# EAGLE design receiver (EAGLE 7.4.0)
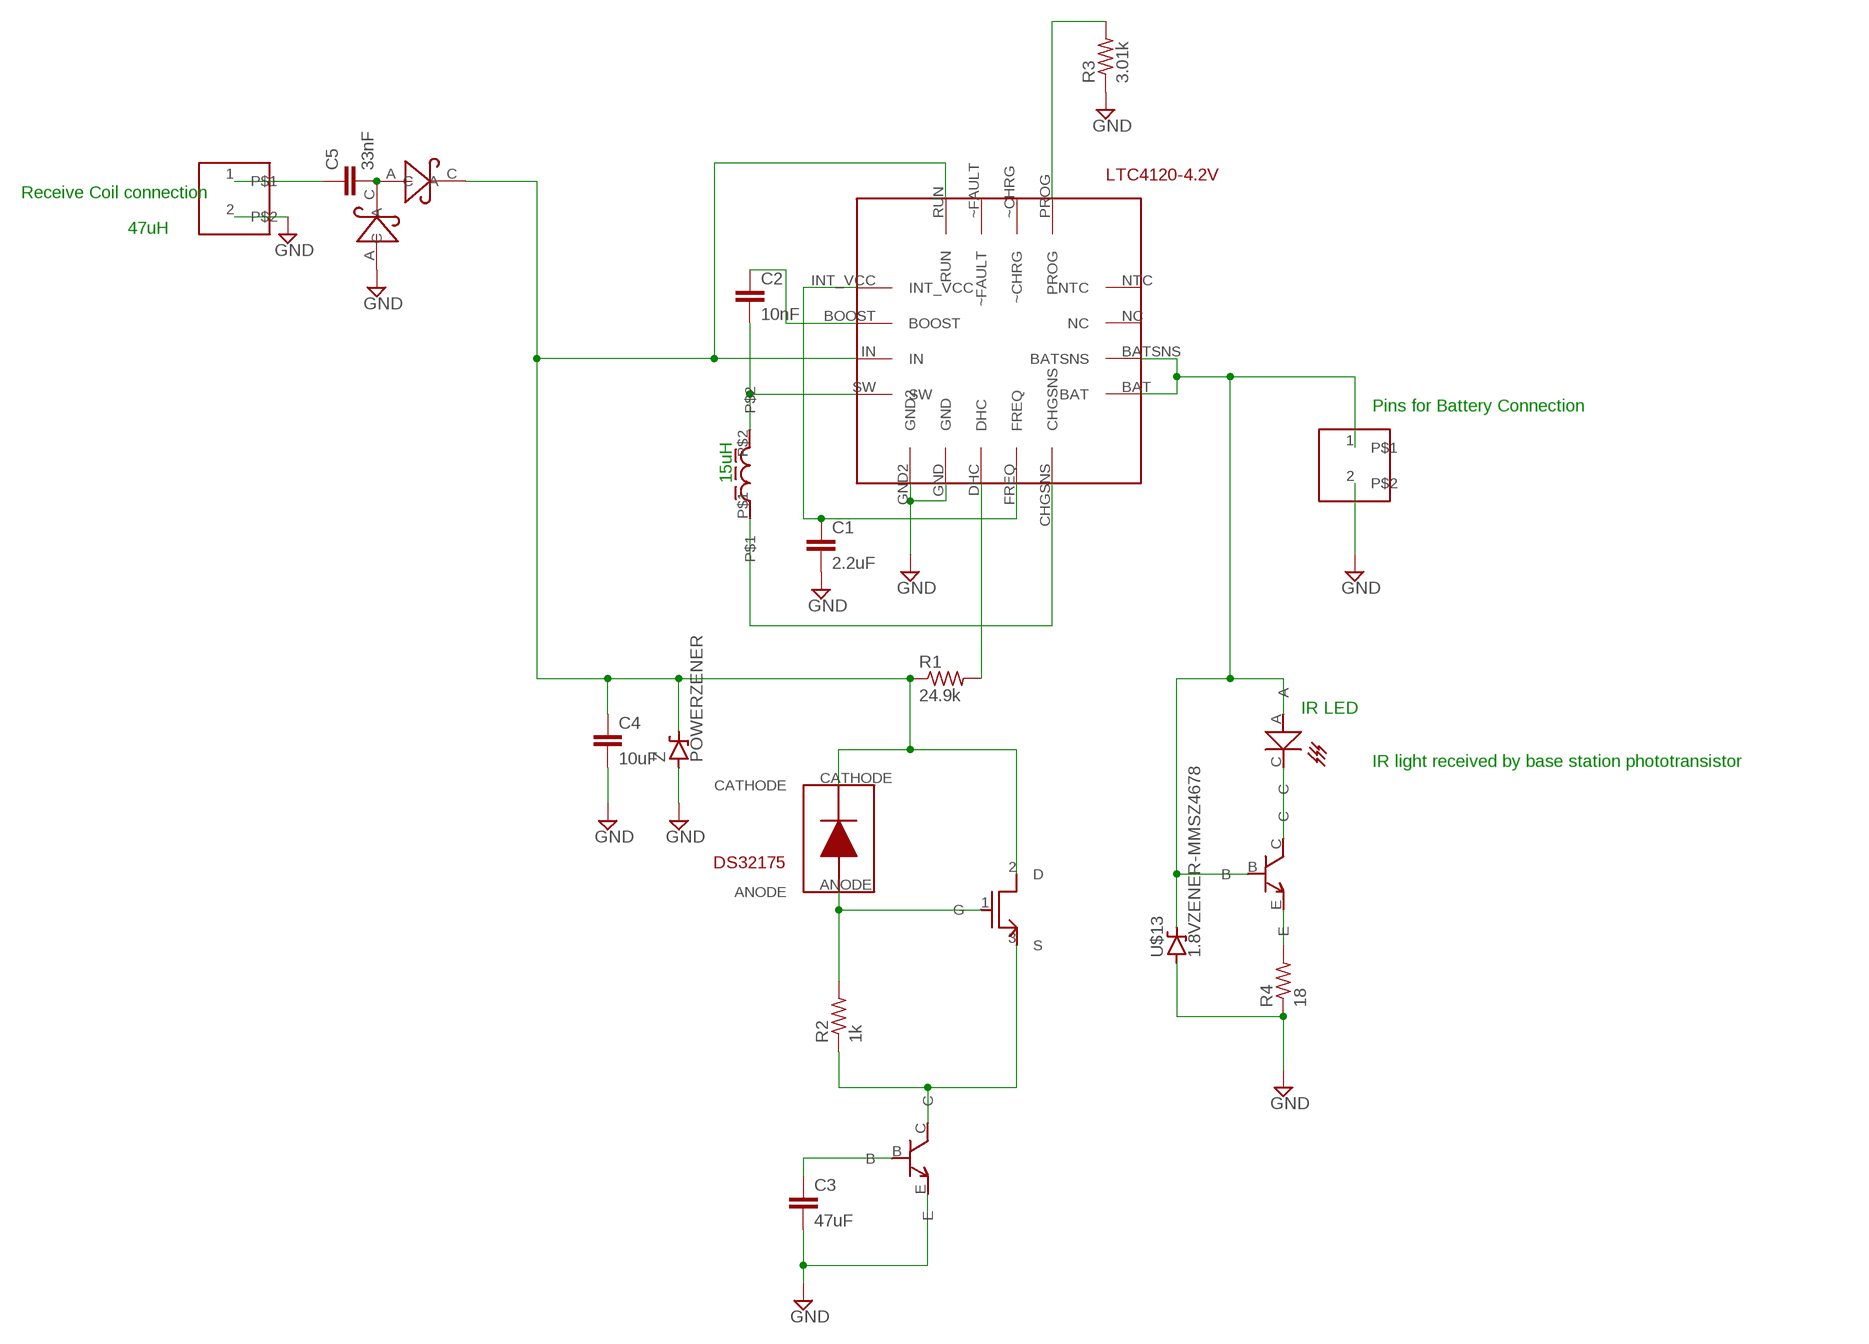
[diagram p0: schematic, sheet 1]

## Parts
C1  2.2uF  C-EUC0805K  [C0805K]
C2  10nF  C-EUC0805K  [C0805K]
C3  47uF  C-EUC0805K  [C0805K]
C4  10uF  C-EUC0805K  [C0805K]
C5  33nF  C-EUC0805K  [C0805K]
PS  SCHTKYPOWER  [POWERDI123]
PS2  SCHTKYPOWER  [POWERDI123]
R1  24.9k  R-US_R0805  [R0805]
R2  1k  R-US_R0805  [R0805]
R3  3.01k  R-US_R0805  [R0805]
R4  18  R-US_R0805  [R0805]
U$1  LTC4120-4.2V  [LTC4120-4.2V]
U$2  1X02  [1X02]
U$3  15UH-INDUCTOR  [15UH-INDUCTOR]
U$4  BAS521  [BAS521-V-DIODE]
U$5  M1-RSD140P06  [DPAKTO252]
U$6  NPN-MMBT3904  [SOT23]
U$10  1X02  [1X02]
U$11  IRLED  [IRLED]
U$13  1.8VZENER-MMSZ4678  [SOD-123]
U$14  NPN-MMBT3904  [SOT23]
Z  POWERZENER  [POWERDI123]

## Nets
GND: C1.2 C3.2 C4.2 PS2.A R3.1 R4.1 U$1.GND U$1.GND2 U$2.2 U$6.E U$10.2 U$13.A Z.A
N$1: C1.1 U$1.FREQ U$1.INT_VCC
N$2: U$1.CHGSNS U$3.P$1
N$3: C4.1 PS.C R1.1 U$1.IN U$1.RUN U$4.CATHODE U$5.2(D) Z.C
N$4: C2.1 U$1.BOOST
N$5: C2.2 U$1.SW U$3.P$2
N$6: R1.2 U$1.DHC
N$7: R2.2 U$4.ANODE U$5.1(G)
N$8: R2.1 U$5.3(S) U$6.C
N$9: C5.1 U$2.1
N$10: C5.2 PS2.C PS.A
N$11: C3.1 U$6.B
N$12: R3.2 U$1.PROG
N$13: U$1.BAT U$1.BATSNS U$10.1 U$11.A U$13.C U$14.B
N$15: R4.2 U$14.E
N$17: U$11.C U$14.C
Unconnected: U$1.NC U$1.NTC U$1.~CHRG U$1.~FAULT

## Notes on the sheet
- Receive Coil connection
- 47uH
- Pins for Battery Connection
- 15uH
- IR LED
- IR light received by base station phototransistor

## Library data of the parts
C1-C5 = resistor:C-EU: CAPACITOR, European symbol
PS PS2 = foe-scale:SCHTKYPOWER
R1-R4 = resistor:R-US_: RESISTOR, American symbol
U$1 = foe-scale:LTC4120-4.2V
U$2 U$10 = foe-scale:1X02
U$3 = foe-scale:15UH-INDUCTOR
U$4 = foe-scale:BAS521
U$5 = foe-scale:M1-RSD140P06
U$6 U$14 = foe-scale:NPN-MMBT3904
U$11 = foe-scale:IRLED
U$13 = foe-scale:1.8VZENER-MMSZ4678
Z = foe-scale:POWERZENER

## Board
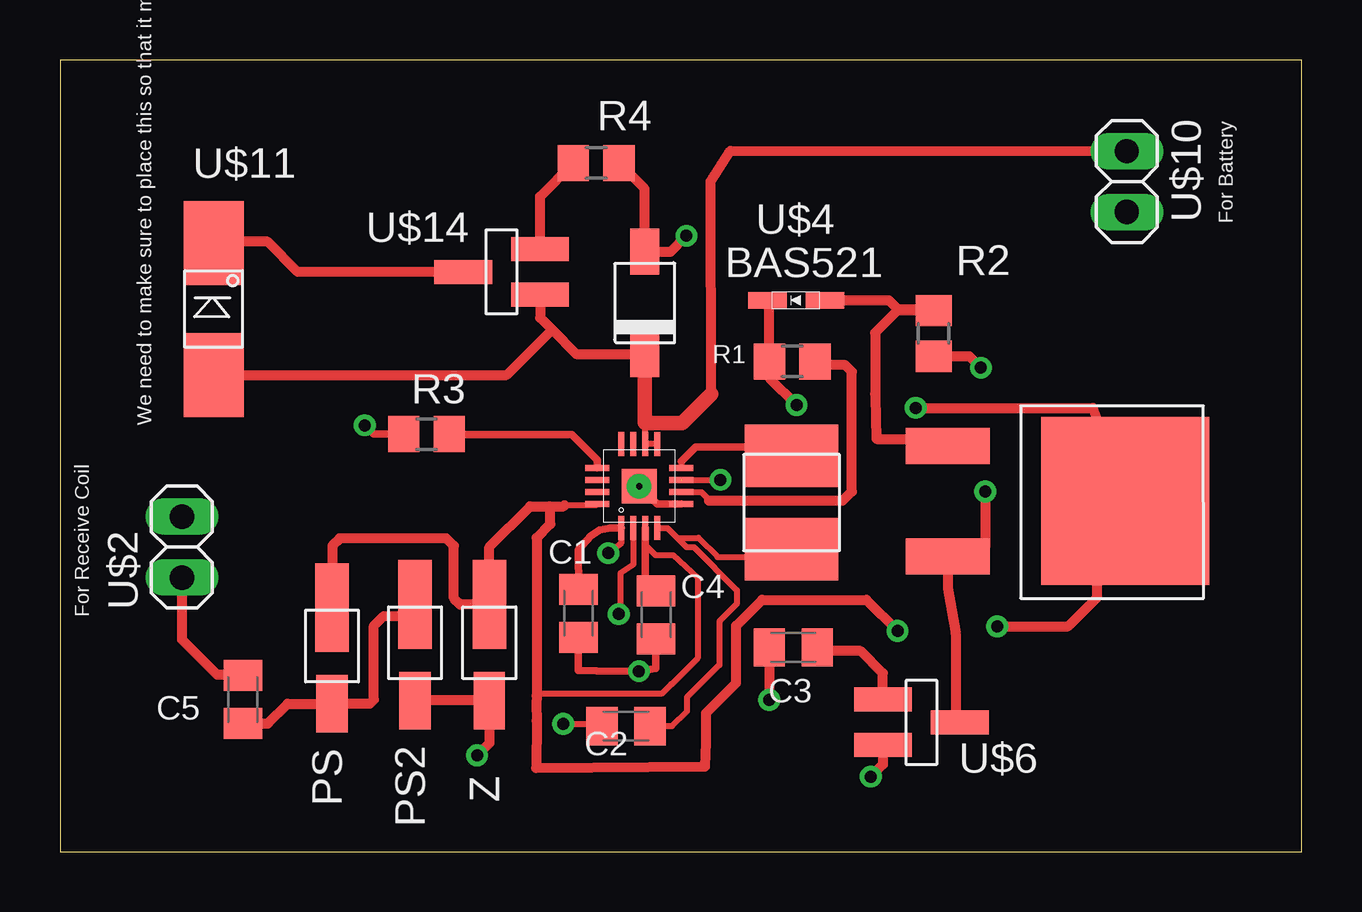
[diagram p1: board, top side]
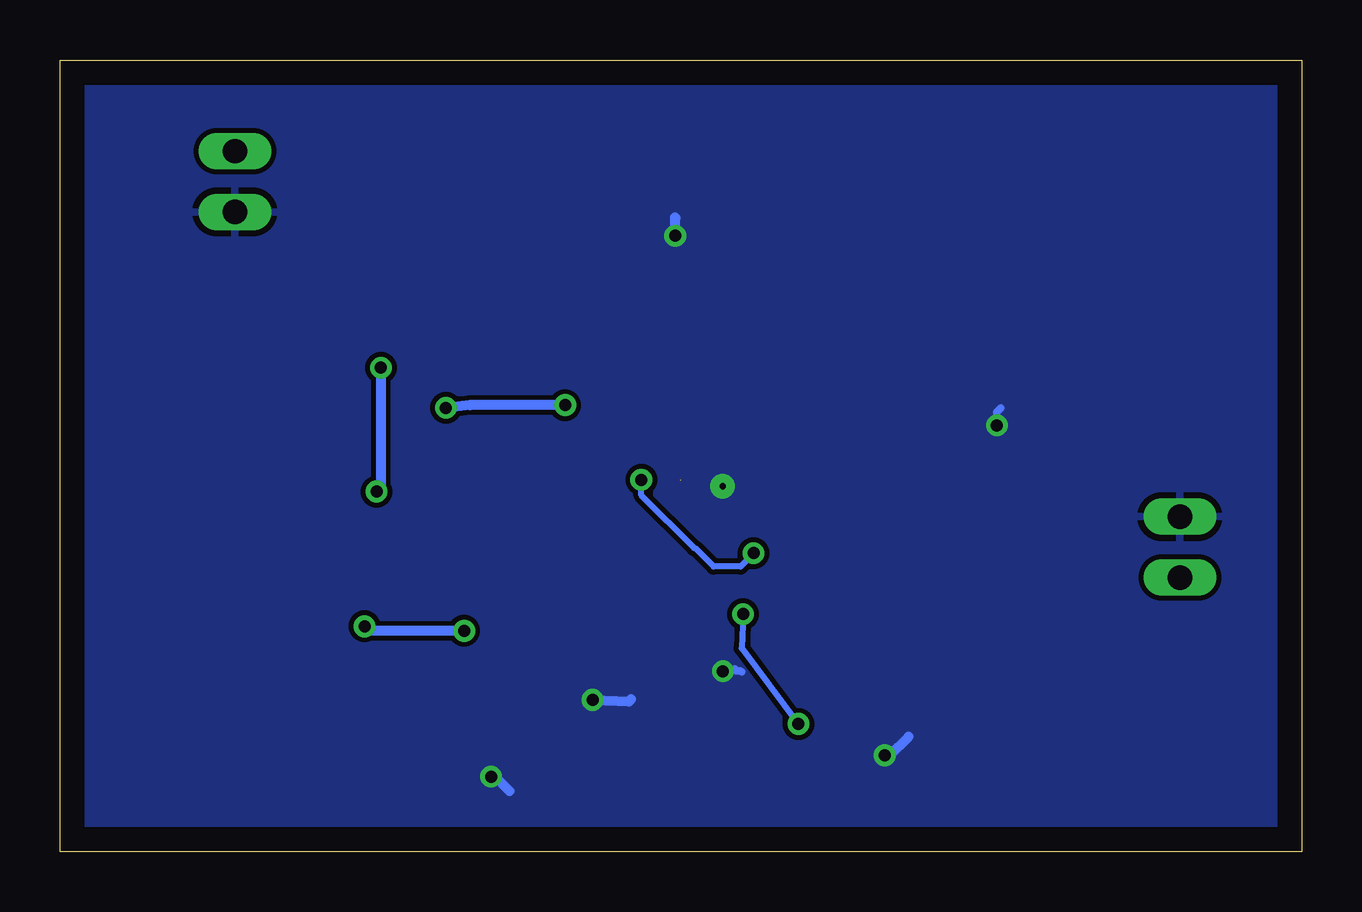
[diagram p2: board, bottom side, seen from below]

Size 51.74 x 33.01 mm. Coordinates in mm from the lower left corner, seen from the top.
Outline: 0,0 51.74,0 51.74,33.01 0,33.01 0,0
Copper layers (1*16): Top 0.035mm / dielectric 1.5mm / Bottom 0.035mm
Design rules "default": minimum track width 10mil, minimum drill 24mil, track to track 8mil, track to pad 8mil, pad to pad 8mil, via to via 8mil, smd to smd 8mil, copper to edge 40mil, drill to drill 8mil, minimum pad ring 10mil, minimum via ring 8mil, stop-mask expansion 4mil, vias tented up to drill 0mil, thermal gap 10mil

### Footprints (pad centres in the part's own frame; a part is rotated, then mirrored left to right if it is on the bottom)
C0805K = smd 1.3 x 1.6: 1 -1,0; 2 1,0
POWERDI123 = smd 2.4 x 1.3: A 4.4,-0.7 | smd 3.7 x 1.4: C 0.4,-0.7
R0805 = smd 1.3 x 1.5: 1 -0.95,0; 2 0.95,0
LTC4120-4.2V = smd 0.25 x 1: BAT 0.75,1.75; BATSNS 0.25,1.75; BOOST -0.25,-1.75; IN 0.25,-1.75; INT_VCC -0.75,-1.75; NC -0.25,1.75; NTC -0.75,1.75; SW 0.75,-1.75 | smd 1 x 0.25: CHGSNS 1.75,0.75; DHC 1.75,-0.25; FREQ 1.75,0.25; GND 1.75,-0.75; PROG -1.75,0.75; RUN -1.75,-0.75; ~CHRG -1.75,0.25; ~FAULT -1.75,-0.25 | smd 1.45 x 1.45: GND2 0,0
1X02 = drill 1.016 long: 1 -1.27,0; 2 1.27,0
15UH-INDUCTOR = smd 3.9 x 2.6: P$1 0,0; P$2 0,3.9
BAS521-V-DIODE = smd 1.6 x 0.7: ANODE -1.211,0; CATHODE 1.186,0
DPAKTO252 = smd 1.5 x 3.5: 1 0,-0.5; 3 4.6,-0.5 | smd 7 x 7: 2 2.3,6.9
SOT23 = smd 1 x 2.4: B 0,0; C 0.95,3.2; E 1.9,0
IRLED = smd 3.5 x 2.5: A 5.5,0; C 0,0
SOD-123 = smd 1.915 x 1.219: A 0,0; C 4.277,0

### Placement (x,y rotation side)
C1  21.6,9.94 270 top
C2  23.58,5.24 0 top
C3  30.55,8.52 180 top
C4  24.84,9.88 270 top
C5  7.62,6.35 270 top
PS  12.03,10.58 270 top
PS2  15.49,10.71 270 top
R1  30.51,20.44 0 top
R2  36.4,21.61 90 top
R3  15.27,17.41 0 top
R4  22.34,28.71 180 top
U$1  24.13,15.24 0 top
U$2  5.08,12.7 90 top
U$3  30.48,16.51 180 top
U$4  30.66,22.99 180 top
U$5  37.49,16.92 270 top
U$6  34.29,6.35 270 top
U$10  44.45,27.94 270 top
U$11  6.4,25.38 270 top
U$13  24.36,25.02 270 top
U$14  20,23.22 90 top
Z  18.59,10.71 270 top

### Tracks (layer width: path | path; a pad name or v marks a point on that pad's centre or on a via)
GND  (via drill 0.25 pad 1.02, 0.5)
  Top 0.305: U$1.GND 24.88,14.49 U$1.GND2 | C4.2 24.83,7.65 v24.12,7.53 22.36,7.54 21.59,7.56 C1.2 | R3.1 13.07,17.41 v12.7,17.78
  Top 0.406: R4.1 24.36,27.64 U$13.A 25.44,25.02 v26.1,25.68 | C3.2 v29.55,6.33 | U$6.E 34.29,3.64 v33.78,3.13 | PS2.A Z.A 17.89,4.53 v17.38,4.02
  Bottom 0.305: v24.12,7.53 23.63,7.62 23.56,7.55 23.4,7.55 23.34,7.49 | v12.7,17.78 12.7,18.34 12.55,18.49
  Bottom 0.406: v29.55,6.33 28.03,6.27 27.94,6.36 | v33.78,3.13 33.61,3.13 33.02,2.54 | v17.38,4.02 17.16,4.02 16.38,4.8 | v26.1,25.68 26.1,26.42 26.12,26.44
  other vias: 24.13,15.24
  pour Bottom: 0,33.02 50.8,33.02 50.8,0 0,0
N$1  (via drill 0.5)  (1 unrouted)
  Top 0.254: U$1.INT_VCC 23.38,12.85 v22.84,12.45 | 25.9,15.51 v27.52,15.51
  Top 0.305: U$1.INT_VCC 22.94,13.49 22.48,13.42 22.12,13.17 21.6,12.59 C1.1
  Bottom 0.254: v22.84,12.45 23.08,12.19 23.38,11.89 24.51,11.89 25.28,12.66 25.32,12.66 27.52,14.86 v27.52,15.51
N$2
  Top 0.254: 25.88,16.28 U$1.CHGSNS
  Top 0.305: 25.88,16.28 26.48,16.88 30.11,16.88 U$3.P$1
N$3  (via drill 0.5)
  Top 0.254: 21.03,14.45 22.34,14.45 U$1.RUN | U$1.IN 24.36,12.82 24.81,12.37 25.54,12.37 26.57,11.42 26.57,8.07 25.48,6.98 25.46,6.98 25.07,6.59 19.94,6.59 19.86,6.51
  Top 0.305: U$1.IN 24.38,10.93 C4.1
  Top 0.406: U$4.CATHODE 29.56,22.9 R1.1 29.56,19.75 v30.69,18.62 | v35.66,18.51 43.04,18.51 U$5.2 43.21,14.53 43.21,10.61 42,9.4 v39.05,9.4 | PS.C 11.35,10.2 11.35,12.77 11.65,13.07 16.09,13.07 16.41,12.75 16.41,10.57 16.67,10.31 Z.C 17.89,12.7 19.59,14.4 20.4,14.4 | v34.9,9.21 33.6,10.51 29.25,10.5 28.17,9.42 28.17,7.04 26.92,5.79 26.92,4.56 26.88,3.56 19.84,3.49 19.86,5.46 19.85,6.17 19.86,6.51 19.86,13.09 20.43,13.66 20.43,14.37 20.4,14.4 | 20.4,14.4 20.98,14.4 21.03,14.45
  Bottom 0.406: v30.69,18.62 34.66,18.62 v35.66,18.51 | v34.9,9.21 38.86,9.21 v39.05,9.4
N$4  (via drill 0.5)
  Top 0.254: U$1.BOOST 23.88,11.96 23.35,11.61 23.35,9.92 v23.28,9.91 | v20.97,5.33 22.17,5.34 22.64,5.35 22.51,5.82 C2.1
  Bottom 0.254: v23.28,9.91 23.34,8.49 v20.97,5.33
N$5
  Top 0.254: U$1.SW 25.31,13.49 25.71,13.09 | 25.71,13.09 26.6,13.09 27.4,12.29 30.16,12.29 U$3.P$2 | 25.71,13.09 26.1,12.7 26.4,12.7 28.2,10.9 28.2,10.34 27.47,9.61 27.47,7.79 26.13,6.45 26.13,5.86 25.51,5.24 C2.2
N$6
  Top 0.254: U$1.DHC 26.72,14.99 27.05,14.66 27.05,14.64
  Top 0.406: 27.05,14.64 32.61,14.64 32.99,15.02 32.99,20.02 32.72,20.29 31.61,20.29 R1.2
N$7
  Top 0.406: U$4.ANODE 34.54,22.99 34.9,22.63 36.33,22.63 R2.2 34.88,22.56 33.96,21.64 33.96,19.1 33.97,18.98 34.02,17.21 35.43,17.21 U$5.1
N$8  (via drill 0.5)
  Top 0.406: R2.1 37.89,20.66 v38.37,20.18 | v38.55,15.02 38.55,12.68 38.48,12.61 36.01,12.61 U$5.3 36.99,10.98 37.32,9.11 37.33,5.56 U$6.C
  Bottom 0.406: v38.37,20.18 38.37,15.2 v38.55,15.02
N$9
  Top 0.406: U$2.1 5.08,8.85 6.54,7.39 7.58,7.39 C5.1
N$10
  Top 0.406: PS2.C 14.31,9.83 13.49,9.83 13.08,9.42 13.08,6.34 12.92,6.18 PS.A 9.48,6.17 8.66,5.35 C5.2
N$11
  Top 0.406: U$6.B 34.29,7.44 33.36,8.37 31.7,8.37 C3.1
N$12
  Top 0.305: U$1.PROG 22.38,16.34 21.33,17.39 16.58,17.39 R3.2
N$13
  Top 0.254: 24.38,17.87 U$1.BATSNS U$1.BAT
  Top 0.406: 27.14,19.05 27.14,19.09 27.11,27.95 27.93,29.22 U$10.1 | U$14.B 20,22.27 20.5,21.77 | 20.5,21.77 21.51,20.76 24.34,20.76 U$13.C | U$11.A 18.61,19.88 20.5,21.77
  Top 0.61: U$13.C 24.36,17.89 24.38,17.87 25.92,17.87 27.14,19.09
N$15
  Top 0.406: U$14.E 20,27.32 R4.2
N$17
  Top 0.406: U$14.C 9.91,24.17 8.65,25.43 6.45,25.43 U$11.C

### Text on the board
tPlace: For Battery | We need to make sure to place this so that it matches with the base station phototransistor | For Receive Coil